# EAGLE design power_xt60_frontpanel (EAGLE 9.6.2)
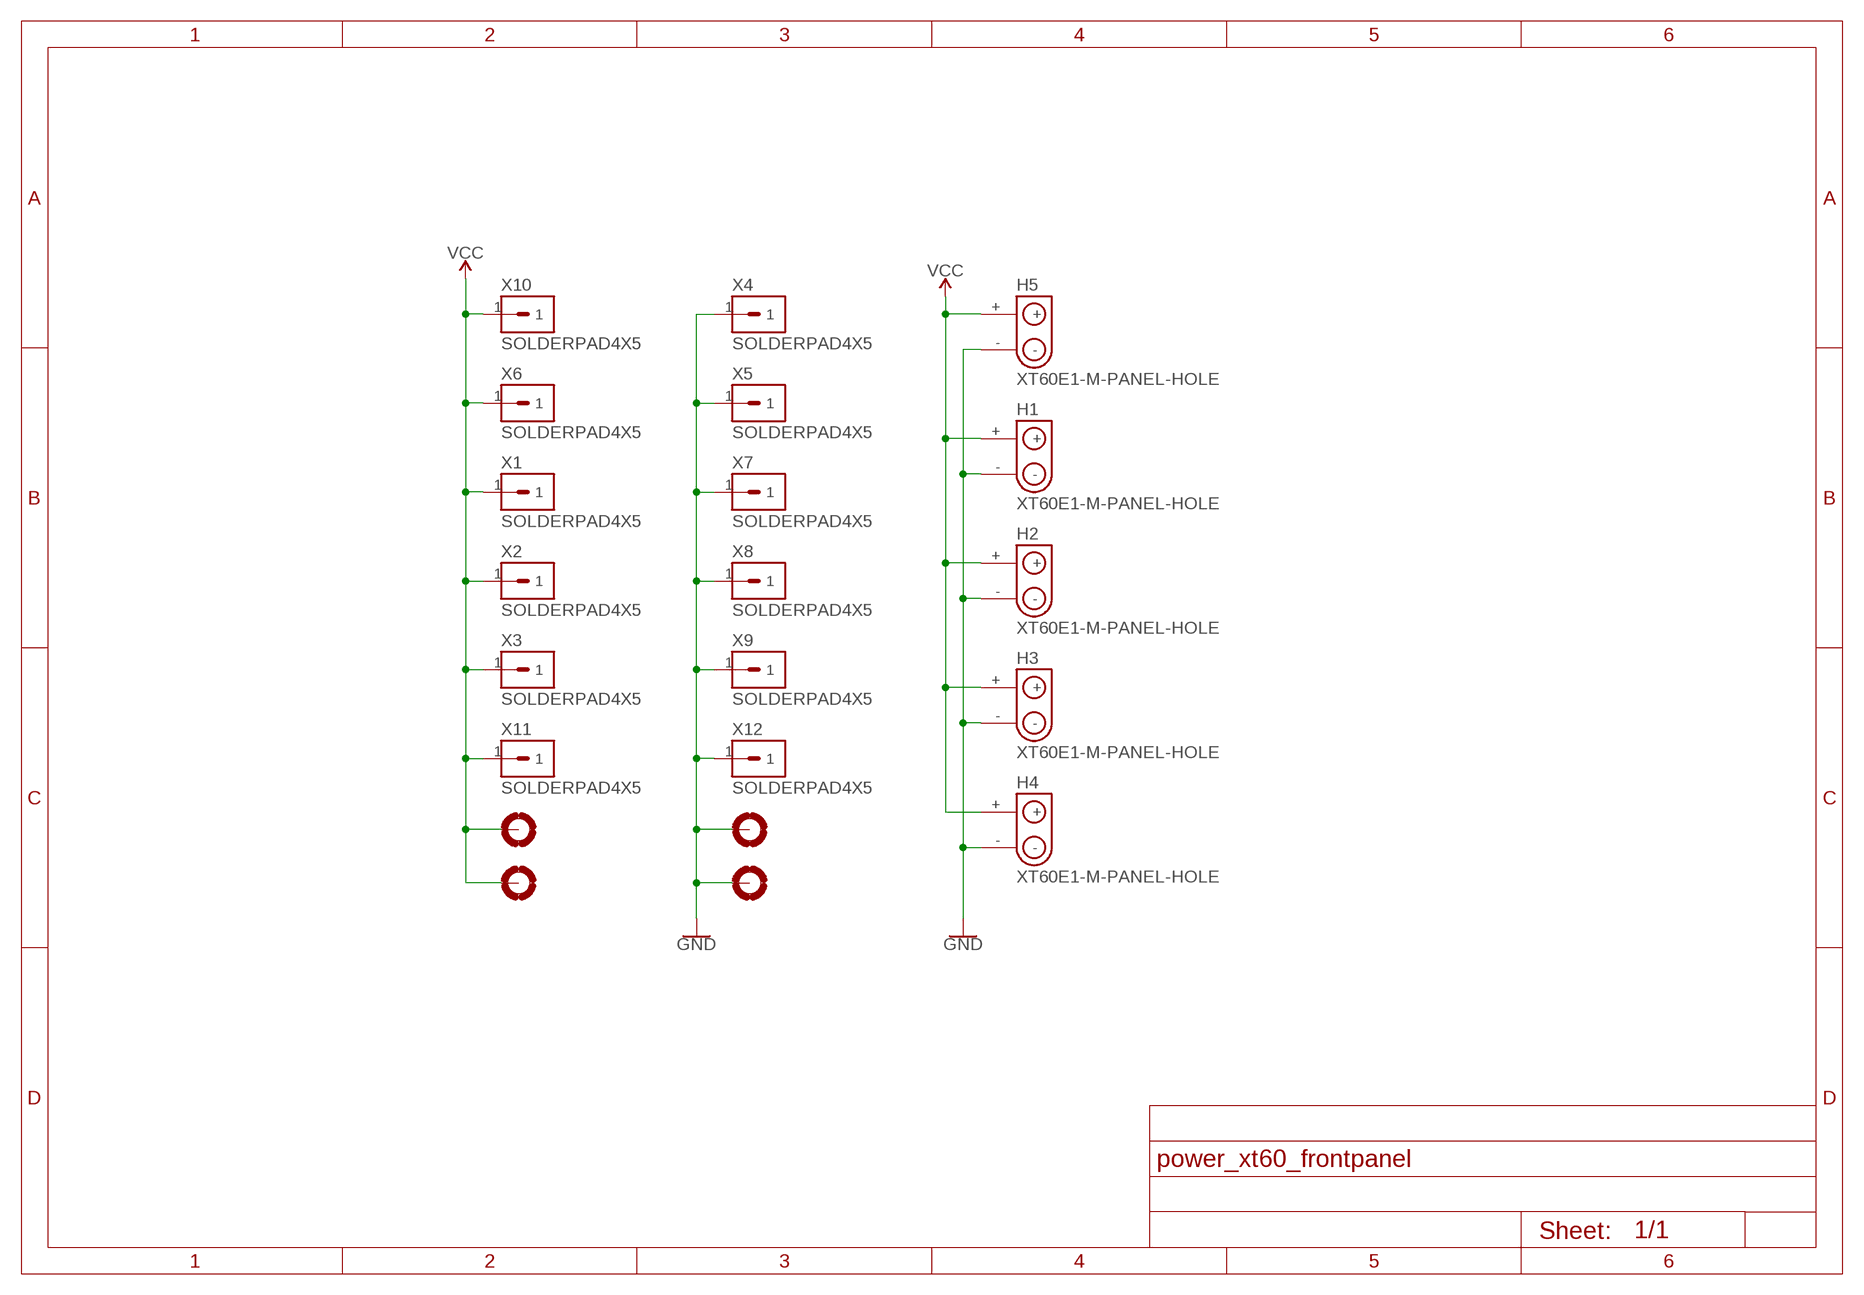
[diagram p0: schematic, sheet 1]

## Parts
H1  XT60E1-M-PANEL-HOLE  [XT60E1-M-PANEL-HOLE]
H2  XT60E1-M-PANEL-HOLE  [XT60E1-M-PANEL-HOLE]
H3  XT60E1-M-PANEL-HOLE  [XT60E1-M-PANEL-HOLE]
H4  XT60E1-M-PANEL-HOLE  [XT60E1-M-PANEL-HOLE]
H5  XT60E1-M-PANEL-HOLE  [XT60E1-M-PANEL-HOLE]
H6  MOUNTHOLE-PAD3.2  [3.2-PAD]
H7  MOUNTHOLE-PAD3.2  [3.2-PAD]
H8  MOUNTHOLE-PAD3.2  [3.2-PAD]
H9  MOUNTHOLE-PAD3.2  [3.2-PAD]
X1  SOLDERPAD4X5  [SOLDERPAD-4X5]
X2  SOLDERPAD4X5  [SOLDERPAD-4X5]
X3  SOLDERPAD4X5  [SOLDERPAD-4X5]
X4  SOLDERPAD4X5  [SOLDERPAD-4X5]
X5  SOLDERPAD4X5  [SOLDERPAD-4X5]
X6  SOLDERPAD4X5  [SOLDERPAD-4X5]
X7  SOLDERPAD4X5  [SOLDERPAD-4X5]
X8  SOLDERPAD4X5  [SOLDERPAD-4X5]
X9  SOLDERPAD4X5  [SOLDERPAD-4X5]
X10  SOLDERPAD4X5  [SOLDERPAD-4X5]
X11  SOLDERPAD4X5  [SOLDERPAD-4X5]
X12  SOLDERPAD4X5  [SOLDERPAD-4X5]

## Nets
GND: H1.- H2.- H3.- H4.- H5.- H8.B3,2(MOUNT) H9.B3,2(MOUNT) X4.1 X5.1 X7.1 X8.1 X9.1 X12.1
VCC: H1.+ H2.+ H3.+ H4.+ H5.+ H6.B3,2(MOUNT) H7.B3,2(MOUNT) X1.1 X2.1 X3.1 X6.1 X10.1 X11.1

## Library data of the parts
H1-H5 = M2M-Holes:XT60E1-M-PANEL-HOLE
H6-H9 = M2M-Holes:MOUNTHOLE-PAD
X1-X12 = M2M-Connectors:SOLDERPAD

## Board
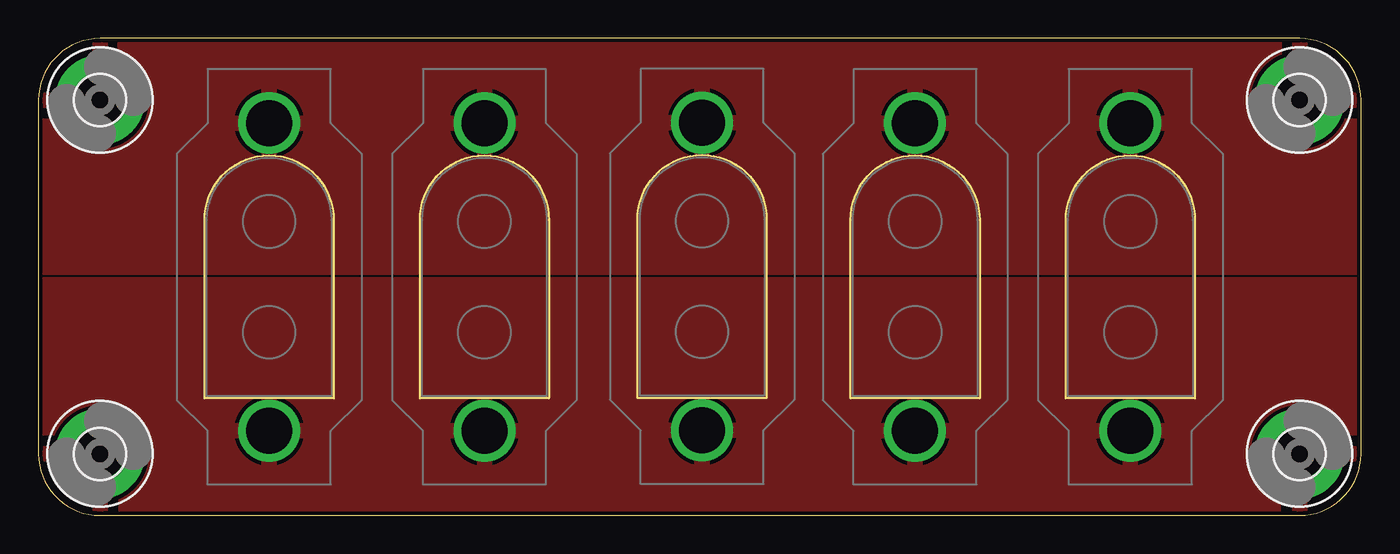
[diagram p1: board, top side]
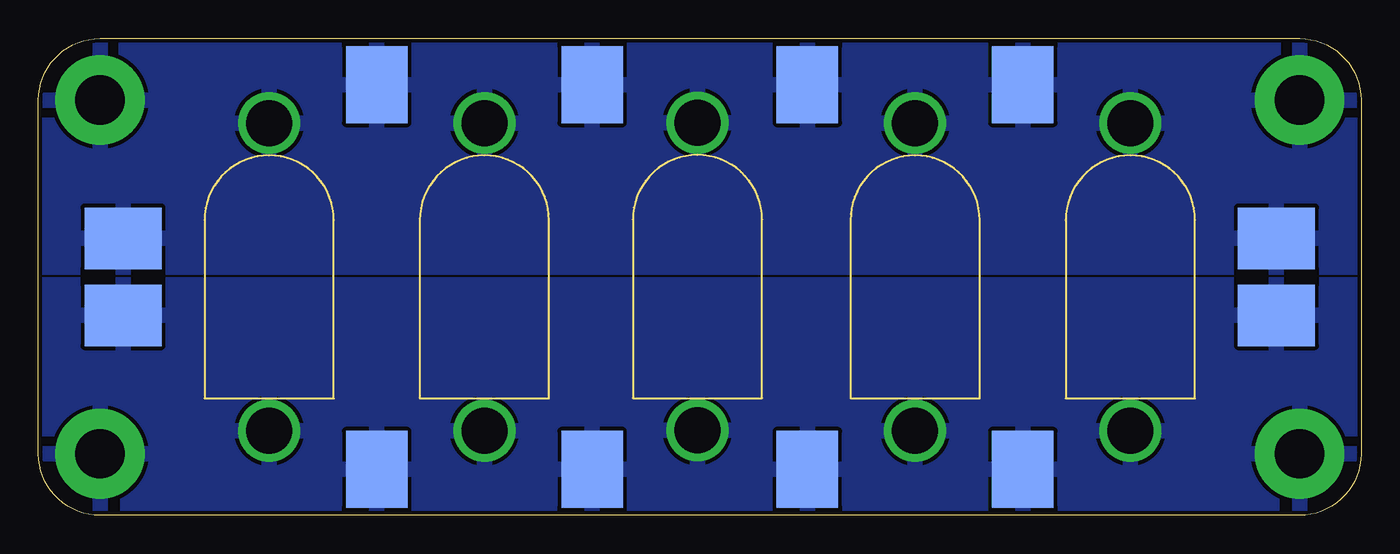
[diagram p2: board, bottom side, seen from below]

Size 86 x 31 mm. Coordinates in mm from the lower left corner, seen from the top.
Outline: 86,4 86,27 arc90 82,31 4,31 arc90 0,27 0,4 arc90 4,0 82,0 arc90 86,4
Copper layers (1*16): Top 0.035mm / dielectric 1.5mm / Bottom 0.035mm
Design rules "SeeedStudio_2layer_DRU_no_angle_20140221": minimum track width 6mil, minimum drill 0.3mm, track to track 6mil, track to pad 6mil, pad to pad 6mil, via to via 6mil, smd to smd 0mil, copper to edge 10mil, drill to drill 10mil, minimum pad ring 2mil, minimum via ring 6mil, stop-mask expansion 2mil, vias tented up to drill 1000mil, thermal gap 10mil

### Footprints (pad centres in the part's own frame; a part is rotated, then mirrored left to right if it is on the bottom)
XT60E1-M-PANEL-HOLE = drill 3: + 0,10; - 0,-10
3.2-PAD = drill 3.2 pad 5.842: B3,2 0,0
SOLDERPAD-4X5 = smd 4 x 5: 1 0,0

### Placement (x,y rotation side)
H1  15,15.5 180 top
H2  29,15.5 180 top
H3  71,15.5 180 top
H4  43.15,15.53 180 top
H5  57,15.5 180 top
H6  82,4 0 top
H7  4,4 0 top
H8  4,27 0 top
H9  82,27 0 top
X1  80.5,13 90 bottom
X2  64,3 0 bottom
X3  50,3 0 bottom
X4  80.5,18 90 bottom
X5  64,28 0 bottom
X6  22,3 0 bottom
X7  50,28 0 bottom
X8  36,28 0 bottom
X9  22,28 0 bottom
X10  36,3 0 bottom
X11  5.5,13 90 bottom
X12  5.5,18 90 bottom

### Tracks (layer width: path | path; a pad name or v marks a point on that pad's centre or on a via)
GND
  pour Bottom (rank 2): 0,31 0,16 86,16 86,31
  pour Top (rank 2): 0,31 86,31 86,16 0,16
VCC
  pour Bottom: 0,15 86,15 86,0 0,0
  pour Top: 0,15 86,15 86,0 0,0